# Altium project Tetris.PrjPcb
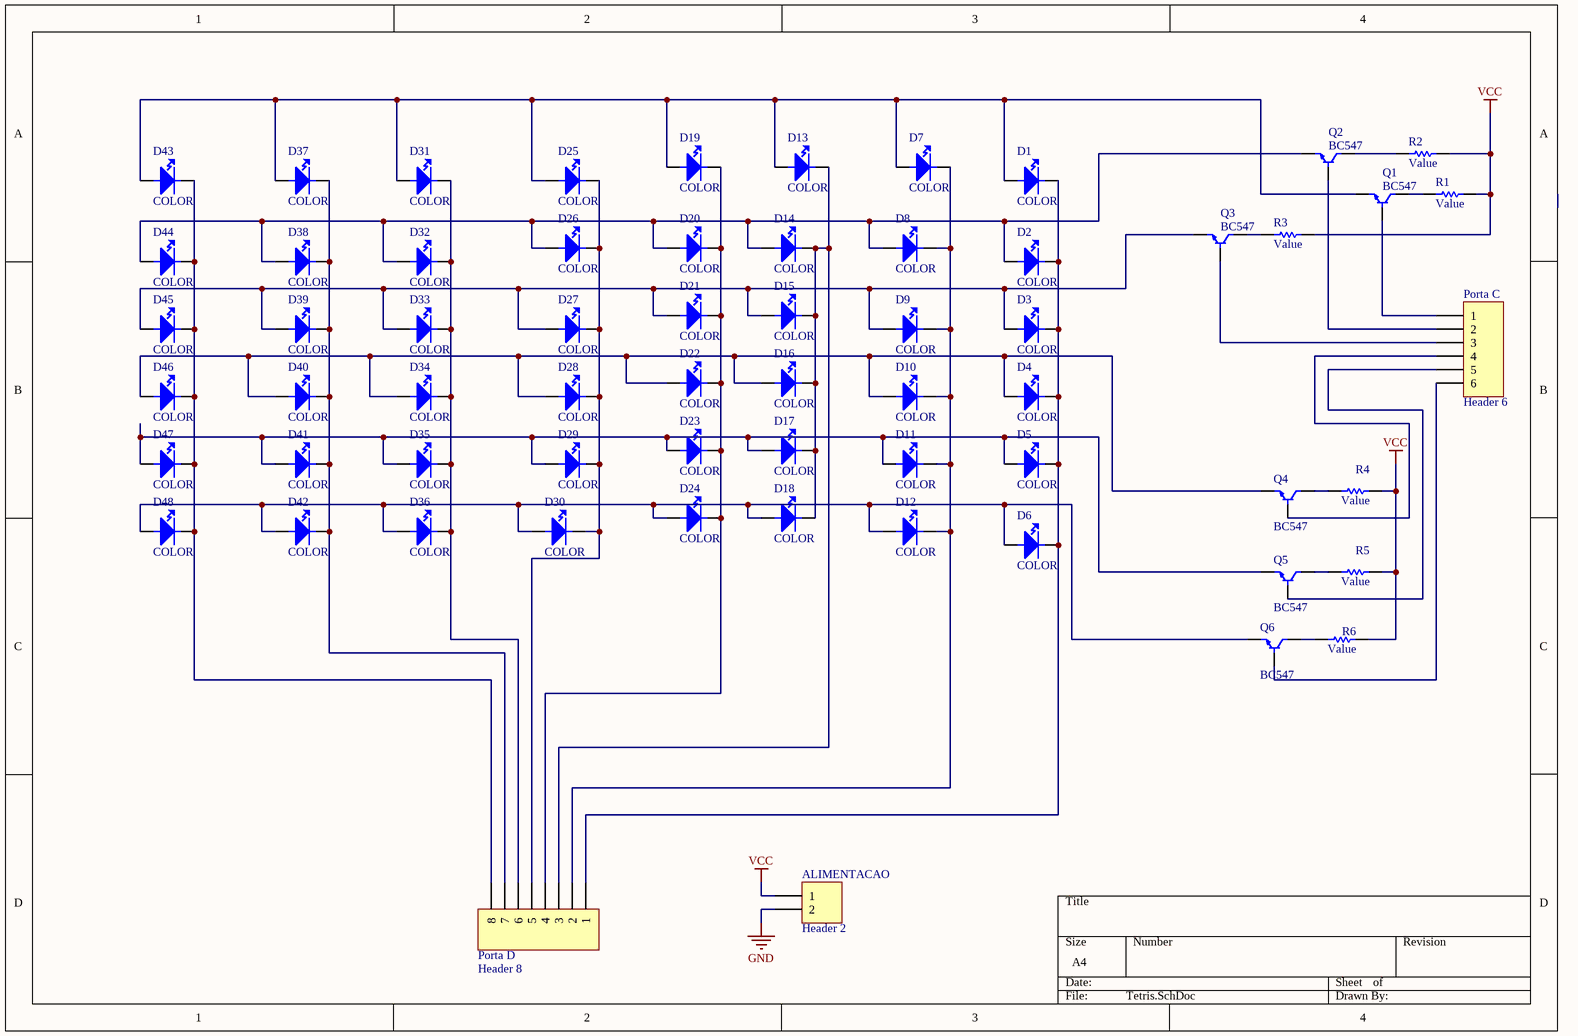
[diagram p0: Tetris.SchDoc]
1 sheet, 63 parts. Net scope: global (net labels, ports and power ports of the same name join across sheets).
Board files: TetrisPlaca.PcbDoc, Placa_PDF.PcbDoc

## Sheet Tetris.SchDoc
size A4

### Parts
ALIMENTACAO  Header 2  [HDR1X2]
D1  COLOR  [TO1-5mm-Yellow]
D2  COLOR  [TO1-5mm-Yellow]
D3  COLOR  [TO1-5mm-Yellow]
D4  COLOR  [TO1-5mm-Yellow]
D5  COLOR  [TO1-5mm-Yellow]
D6  COLOR  [TO1-5mm-Yellow]
D7  COLOR  [TO1-5mm-Yellow]
D8  COLOR  [TO1-5mm-Yellow]
D9  COLOR  [TO1-5mm-Yellow]
D10  COLOR  [TO1-5mm-Yellow]
D11  COLOR  [TO1-5mm-Yellow]
D12  COLOR  [TO1-5mm-Yellow]
D13  COLOR  [TO1-5mm-Yellow]
D14  COLOR  [TO1-5mm-Yellow]
D15  COLOR  [TO1-5mm-Yellow]
D16  COLOR  [TO1-5mm-Yellow]
D17  COLOR  [TO1-5mm-Yellow]
D18  COLOR  [TO1-5mm-Yellow]
D19  COLOR  [TO1-5mm-Yellow]
D20  COLOR  [TO1-5mm-Yellow]
D21  COLOR  [TO1-5mm-Yellow]
D22  COLOR  [TO1-5mm-Yellow]
D23  COLOR  [TO1-5mm-Yellow]
D24  COLOR  [TO1-5mm-Yellow]
D25  COLOR  [TO1-5mm-Yellow]
D26  COLOR  [TO1-5mm-Yellow]
D27  COLOR  [TO1-5mm-Yellow]
D28  COLOR  [TO1-5mm-Yellow]
D29  COLOR  [TO1-5mm-Yellow]
D30  COLOR  [TO1-5mm-Yellow]
D31  COLOR  [TO1-5mm-Yellow]
D32  COLOR  [TO1-5mm-Yellow]
D33  COLOR  [TO1-5mm-Yellow]
D34  COLOR  [TO1-5mm-Yellow]
D35  COLOR  [TO1-5mm-Yellow]
D36  COLOR  [TO1-5mm-Yellow]
D37  COLOR  [TO1-5mm-Yellow]
D38  COLOR  [TO1-5mm-Yellow]
D39  COLOR  [TO1-5mm-Yellow]
D40  COLOR  [TO1-5mm-Yellow]
D41  COLOR  [TO1-5mm-Yellow]
D42  COLOR  [TO1-5mm-Yellow]
D43  COLOR  [TO1-5mm-Yellow]
D44  COLOR  [TO1-5mm-Yellow]
D45  COLOR  [TO1-5mm-Yellow]
D46  COLOR  [TO1-5mm-Yellow]
D47  COLOR  [TO1-5mm-Yellow]
D48  COLOR  [TO1-5mm-Yellow]
Porta_C  Header 6  [HDR1X6]
Porta_D  Header 8  [HDR1X8]
Q1  BC547  [TO-92/CBE]
Q2  BC547  [TO-92/CBE]
Q3  BC547  [TO-92/CBE]
Q4  BC547  [TO-92/CBE]
Q5  BC547  [TO-92/CBE]
Q6  BC547  [TO-92/CBE]
R1  Value  [R400-2.0mm]
R2  Value  [R400-2.0mm]
R3  Value  [R400-2.0mm]
R4  Value  [R400-2.0mm]
R5  Value  [R400-2.0mm]
R6  Value  [R400-2.0mm]

### Nets
GND: ALIMENTACAO.2
VCC: ALIMENTACAO.1 R1.2 R2.2 R3.2 R4.2 R5.2 R6.2
NetD1_A: D1.A D7.A D13.A D19.A D25.A D31.A D37.A D43.A Q1.E
NetD1_K: D1.K D2.K D3.K D4.K D5.K D6.K Porta_D.1
NetD2_A: D2.A D8.A D14.A D20.A D26.A D32.A D38.A D44.A Q2.E
NetD3_A: D3.A D9.A D15.A D21.A D27.A D33.A D39.A D45.A Q3.E
NetD4_A: D4.A D10.A D16.A D22.A D28.A D34.A D40.A D46.A Q4.E
NetD5_A: D5.A D11.A D17.A D23.A D29.A D35.A D41.A D47.A Q5.E
NetD6_A: D6.A D12.A D18.A D24.A D30.A D36.A D42.A D48.A Q6.E
NetD7_K: D7.K D8.K D9.K D10.K D11.K D12.K Porta_D.2
NetD13_K: D13.K D14.K D15.K D16.K D17.K D18.K Porta_D.3
NetD19_K: D19.K D20.K D21.K D22.K D23.K D24.K Porta_D.4
NetD25_K: D25.K D26.K D27.K D28.K D29.K D30.K Porta_D.5
NetD31_K: D31.K D32.K D33.K D34.K D35.K D36.K Porta_D.6
NetD37_K: D37.K D38.K D39.K D40.K D41.K D42.K Porta_D.7
NetD43_K: D43.K D44.K D45.K D46.K D47.K D48.K Porta_D.8
NetPorta_C_1: Porta_C.1 Q1.B
NetPorta_C_2: Porta_C.2 Q2.B
NetPorta_C_3: Porta_C.3 Q3.B
NetPorta_C_4: Porta_C.4 Q4.B
NetPorta_C_5: Porta_C.5 Q5.B
NetPorta_C_6: Porta_C.6 Q6.B
NetQ1_C: Q1.C R1.1
NetQ2_C: Q2.C R2.1
NetQ3_C: Q3.C R3.1
NetQ4_C: Q4.C R4.1
NetQ5_C: Q5.C R5.1
NetQ6_C: Q6.C R6.1

### Library data of the parts
ALIMENTACAO = Header 2: Header, 2-Pin; LatestRevisionDate: 17-Jul-2002; LatestRevisionNote: Re-released for DXP Platform.; Publisher: Altium Limited
D1-D48 = LED: Light Emitting Diode
Porta_C = Header 6: Header, 6-Pin; LatestRevisionDate: 17-Jul-2002; LatestRevisionNote: Re-released for DXP Platform.; Publisher: Altium Limited
Porta_D = Header 8: Header, 8-Pin; LatestRevisionDate: 17-Jul-2002; LatestRevisionNote: Re-released for DXP Platform.; Publisher: Altium Limited
Q1-Q6 = BC547: NPN Epitaxial Silicon Transistor; Complementary Part: BC557; Collector-Base Voltage (Vcb): 50 V; Collector-Emitter Voltage (Vce): 45 V; Emitter-Base Voltage (Veb): 6 V; Collector Current (Ic): 100 mA; Total Power Dissipation (Ptot): 500 mW; DC Current Gain Min (hfe): 110; DC Current Gain Max (hfe): 800; Transition Frequency (fT): 300 MHz
R1-R6 = Resistor: Tolerance: 5%; Published: 8-Jun-2000; LatestRevisionDate: 17-Jul-2002; LatestRevisionNote: Re-released for DXP Platform.; PackageReference: AXIAL-0.3; Publisher: Altium Limited